# Altium schematic sheet MCU.SchDoc
size A
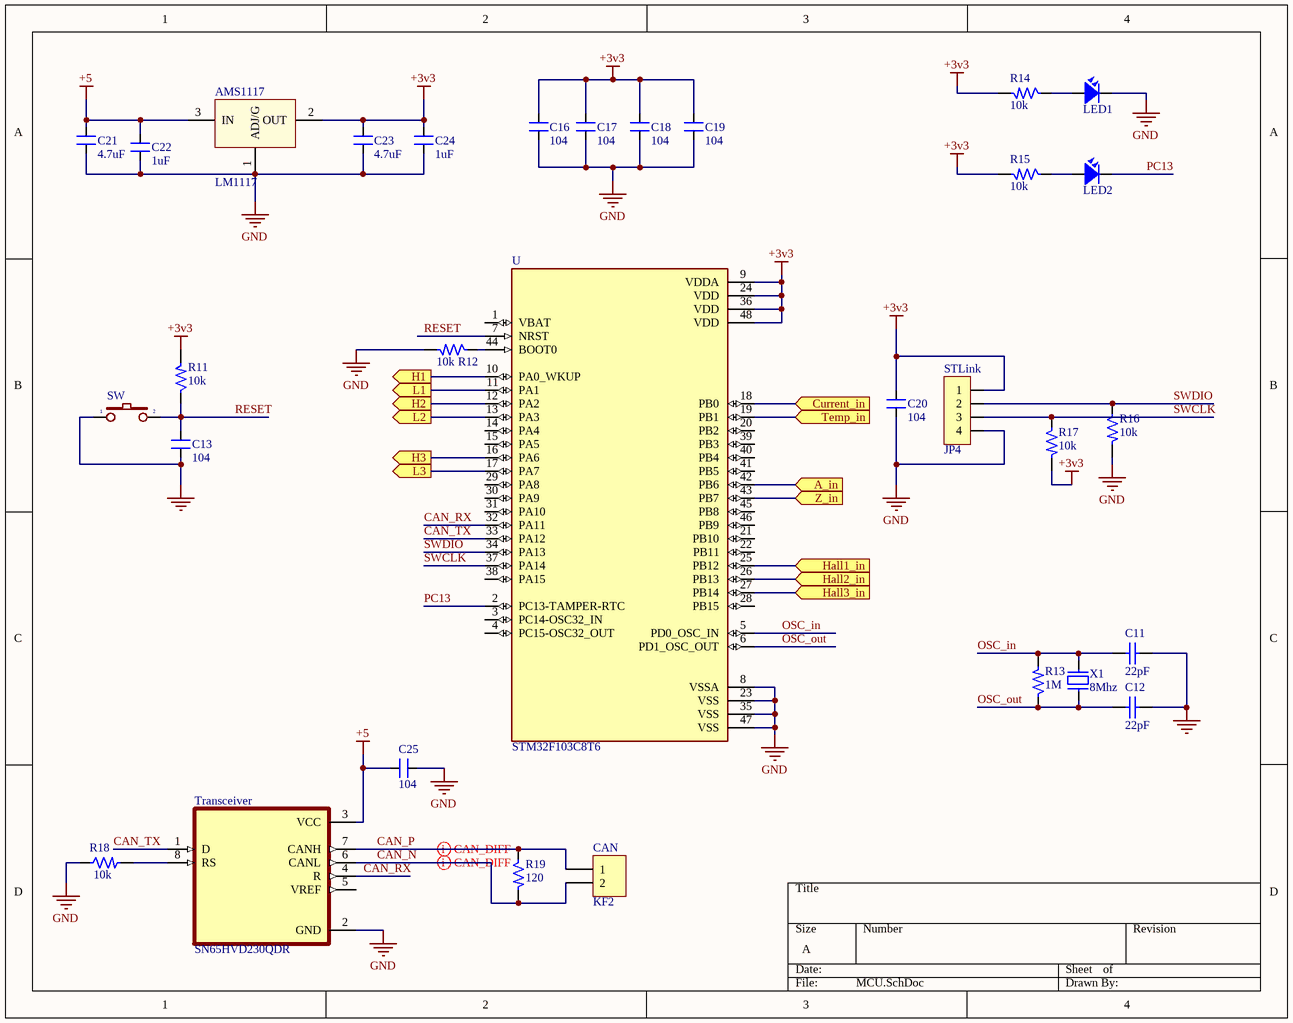
[diagram p0: MCU.SchDoc]

## Parts
AMS1117  LM1117  [SOT223-4N]
C11  22pF  [CAP FILM 0603_1608]
C12  22pF  [CAP FILM 0603_1608]
C13  104  [CAP FILM 0603_1608]
C16  104  [CAP FILM 0603_1608]
C17  104  [CAP FILM 0603_1608]
C18  104  [CAP FILM 0603_1608]
C19  104  [CAP FILM 0603_1608]
C20  104  [CAP FILM 0603_1608]
C21  4.7uF  [CAP FILM 0603_1608]
C22  1uF  [CAP FILM 0603_1608]
C23  4.7uF  [CAP FILM 0603_1608]
C24  1uF  [CAP FILM 0603_1608]
C25  104  [CAP FILM 0603_1608]
CAN  KF2  [KF2-5.08]
LED1  LED SMD  [LED 0603_1608 GREEN]  (value not drawn)
LED2  LED SMD  [LED 0603_1608 GREEN]  (value not drawn)
R11  10k  [RES 0603_1608]
R12  10k  [RES 0603_1608]
R13  1M  [RES 0603_1608]
R14  10k  [RES 0603_1608]
R15  10k  [RES 0603_1608]
R16  10k  [RES 0603_1608]
R17  10k  [RES 0603_1608]
R18  10k  [RES 0603_1608]
R19  120  [RES 0603_1608]
STLink  JP4  [JP4-D1C]
SW  (no value)  [SW1-SMD]
Transceiver  SN65HVD230QDR  [SOIC127P599X175-8N]
U  STM32F103C8T6  [QFP50P900X900X160-48N]
X1  8Mhz  [XTAL-RU49/4]

## Ports
A_in (in), Current_in (in), H1 (out), H2 (out), H3 (out), Hall1_in (in), Hall2_in (in), Hall3_in (in), L1 (out), L2 (out), L3 (out), Temp_in (in), Z_in (in)

## Nets
+3v3: AMS1117.2(OUT) C16.1 C17.1 C18.1 C19.1 C20.1 C23.1 C24.1 R11.2 R14.2 R15.2 R17.2 STLink.1 U.9(VDDA) U.24(VDD) U.36(VDD) U.48(VDD)
+5: AMS1117.3(IN) C21.1 C22.1 C25.1 Transceiver.3(VCC)
GND: AMS1117.1(ADJ/G) C11.1 C12.1 C13.2 C16.2 C17.2 C18.2 C19.2 C20.2 C21.2 C22.2 C23.2 C24.2 C25.2 LED1.2 R12.2 R16.2 R18.1 STLink.4 SW.1 Transceiver.2(GND) U.8(VSSA) U.23(VSS) U.35(VSS) U.47(VSS)
A_in: U.42(PB6) ; port A_in
CAN_N: CAN.2 R19.2 Transceiver.6(CANL)
CAN_P: CAN.1 R19.1 Transceiver.7(CANH)
CAN_RX: Transceiver.4(R) U.32(PA11)
CAN_TX: Transceiver.1(D) U.33(PA12)
Current_in: U.18(PB0) ; port Current_in
H1: U.10(PA0_WKUP) ; port H1
H2: U.12(PA2) ; port H2
H3: U.16(PA6) ; port H3
Hall1_in: U.25(PB12) ; port Hall1_in
Hall2_in: U.26(PB13) ; port Hall2_in
Hall3_in: U.27(PB14) ; port Hall3_in
L1: U.11(PA1) ; port L1
L2: U.13(PA3) ; port L2
L3: U.17(PA7) ; port L3
OSC_in: C11.2 R13.2 U.5(PD0_OSC_IN) X1.2
OSC_out: C12.2 R13.1 U.6(PD1_OSC_OUT) X1.1
PC13: LED2.2 U.2(PC13-TAMPER-RTC)
RESET: C13.1 R11.1 SW.2 U.7(NRST)
SWCLK: R17.1 STLink.3 U.37(PA14)
SWDIO: R16.1 STLink.2 U.34(PA13)
Temp_in: U.19(PB1) ; port Temp_in
Z_in: U.43(PB7) ; port Z_in
NetLED1_1: LED1.1 R14.1
NetLED2_1: LED2.1 R15.1
NetR12_1: R12.1 U.44(BOOT0)
NetR18_2: R18.2 Transceiver.8(RS)

Not connected (* = marked no-connect by the designer): Transceiver 5(VREF); U 1(VBAT) 3(PC14-OSC32_IN) 4(PC15-OSC32_OUT) 14(PA4) 15(PA5) 20(PB2) 21(PB10) 22(PB11) 28(PB15) 29(PA8) 30(PA9) 31(PA10) 38(PA15) 39(PB3) 40(PB4) 41(PB5) 45(PB8) 46(PB9)

## Layout directives
differential pair; differential pair class CAN_DIFF: CAN_N, CAN_P

## Library data of the parts
AMS1117 = LM1117: Available in 1.8V, 2.5V, 2.85V, 3.3V, 5V, and  Adjustable Versions; Value: LM317
C11 C12 = CapSMD: Capacitor; Value: 33p; Published: 8-Jun-2000; LatestRevisionDate: 17-Jul-2002; LatestRevisionNote: Re-released for DXP Platform.; PackageReference: RAD-0.3; Publisher: Altium Limited
C13 C16-C25 = CN: Value: 0,1uF/300V; Designed by: VanDungEvn
CAN = KF2: Manufacturer: Würth Elektronik eiSos GmbH; partNo: 691103110002; ComponentLink1 Description: Manufacturer; ComponentLink2 Description: Datasheet; NoPins: 2; Created Date: 29 October 2013; ComponentLink1URL: http://www.we-online.com; ComponentLink2URL: http://katalog.we-online.de/em/datasheet/6911031100xx.pdf; Created by: Karrer Zheng
LED1 LED2 = LED-SMD-0805
R11-R19 = R: Resistor 1/4W; Value: R1/4W - 1K
STLink = JP4: WR-PHD 2.54 mm Angled Socket Header; Manufacturer: W¨¹rth Elektronik eiSos GmbH; partNo: 613004143121; ComponentLink1 Description: Manufacturer; ComponentLink2 Description: Datasheet; NoPins: 04; Created Date: 29 March 2013; ComponentLink1URL: http://www.we-online.com; ComponentLink2URL: http://katalog.we-online.de/em/datasheet/6130xx143121.pdf; Created by: Karrer Zheng
SW = SW2: Switch button 2 pin; Value: SW chip 2 pin
Transceiver = SN65HVD230QDR: 3.3-V CAN Transceiver with Standby Mode 8-SOIC -40 to 125; MF: Texas Instruments; Package: SOIC-8 Texas Instruments; Price: None; MP: SN65HVD230QDR; Availability: Good; Value: *; Check_prices: https://www.snapeda.com/parts/SN65HVD230QDR/Texas%20Instruments/view-part/1178075/?ref=eda; Purchase-URL: https://pricing.snapeda.com/search/part/SN65HVD230QDR/?ref=eda; SnapEDA_Link: https://www.snapeda.com/parts/SN65HVD230QDR/Texas%20Instruments/view-part/1178075/?ref=snap
U = STM32F103C8T6: ARMÂ® CortexÂ®-M3 STM32F1 Microcontroller IC 32-Bit 72MHz 64KB _64K x 8_ FLASH; MF: STMicroelectronics; Price: None; Package: LQFP-48 STMicroelectronics; Value: *; MP: STM32F103C8T6; Availability: Unavailable; SnapEDA_Link: https://www.snapeda.com/parts/STM32F103C8T6/STMicroelectronics/view-part/52195/?ref=snap
X1 = XT2: Crystal, 32.768 KHz, -40 to 85 degC, 3.2 x 1.5 x 0.9 mm SMD; Value: 4Mhz